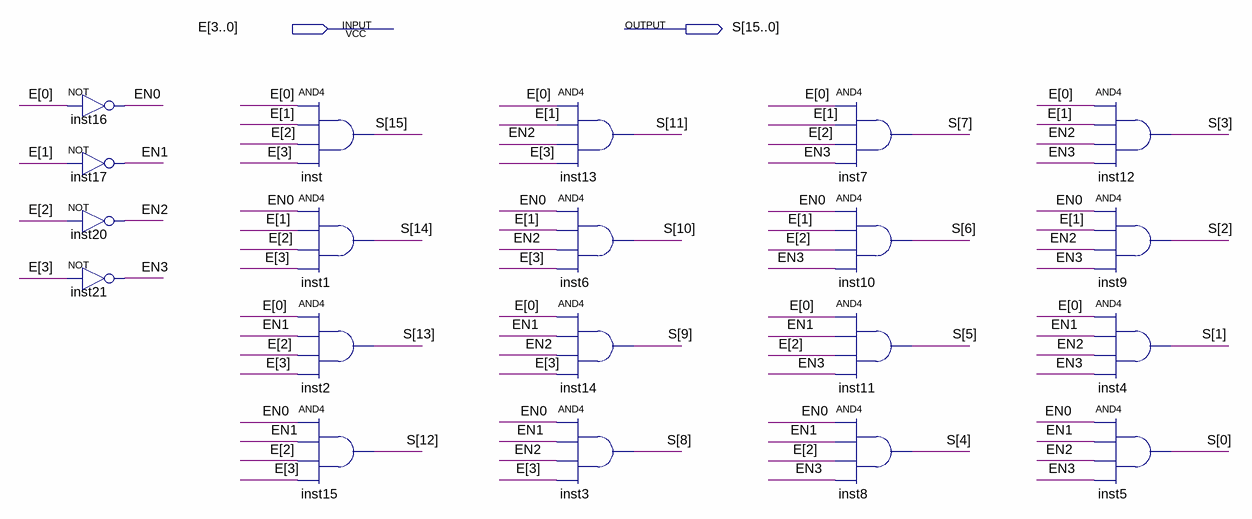
[diagram p0: schematic sheet]
// Quartus schematic DEC_416.bdf as structural Verilog: 20 symbols, 2 pins
module DEC_416 (
  input  [3:0] E,
  output [15:0] S
);

  wire EN0, EN1, EN2, EN3;

  not inst16 (EN0, E[0]);
  not inst17 (EN1, E[1]);
  not inst20 (EN2, E[2]);
  not inst21 (EN3, E[3]);
  and inst (S[15], E[0], E[1], E[2], E[3]);
  and inst1 (S[14], EN0, E[1], E[2], E[3]);
  and inst2 (S[13], E[0], EN1, E[2], E[3]);
  and inst15 (S[12], EN0, EN1, E[2], E[3]);
  and inst13 (S[11], E[0], E[1], EN2, E[3]);
  and inst6 (S[10], EN0, E[1], EN2, E[3]);
  and inst14 (S[9], E[0], EN1, EN2, E[3]);
  and inst3 (S[8], EN0, EN1, EN2, E[3]);
  and inst7 (S[7], E[0], E[1], E[2], EN3);
  and inst10 (S[6], EN0, E[1], E[2], EN3);
  and inst11 (S[5], E[0], EN1, E[2], EN3);
  and inst8 (S[4], EN0, EN1, E[2], EN3);
  and inst12 (S[3], E[0], E[1], EN2, EN3);
  and inst9 (S[2], EN0, E[1], EN2, EN3);
  and inst4 (S[1], E[0], EN1, EN2, EN3);
  and inst5 (S[0], EN0, EN1, EN2, EN3);
endmodule
